# Altium schematic sheet display.SchDoc
size A4; SheetNumber: 5; SheetTotal: 7
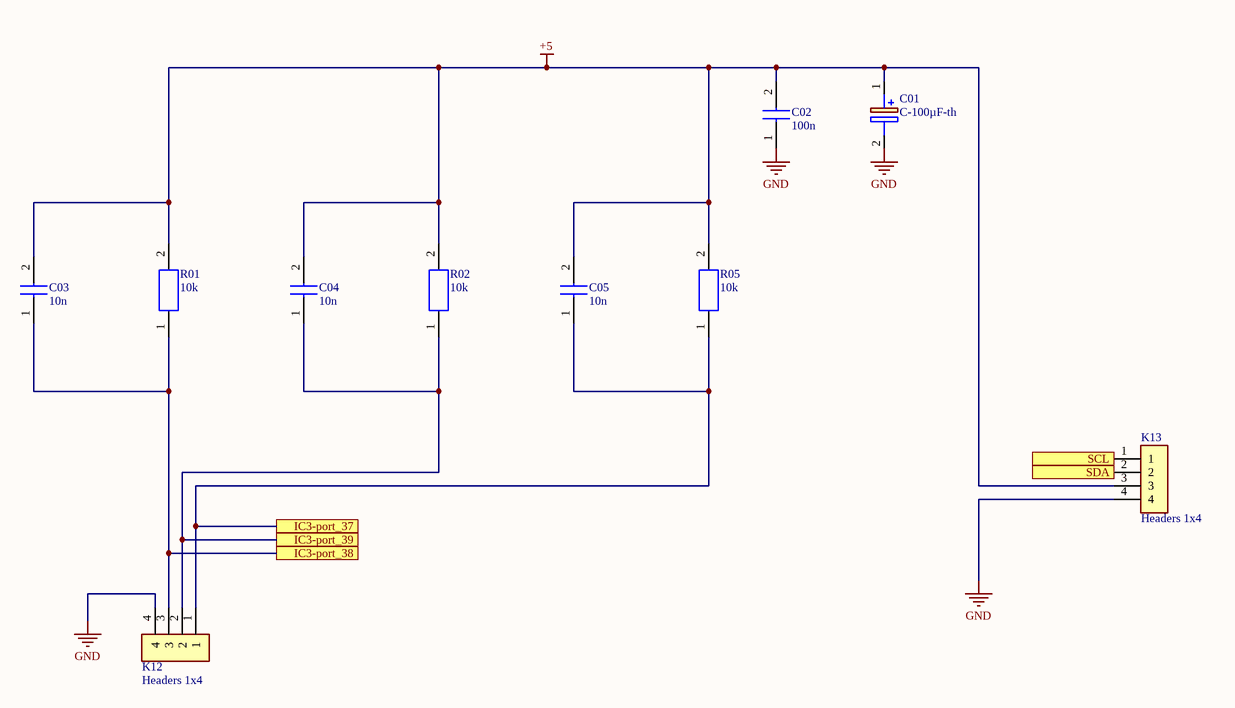
[diagram p0: display.SchDoc]

## Parts
C01  C-100µF-th  [C-100µF-th]
C02  100n  [C-0805-smd]
C03  10n  [C-0805-smd]
C04  10n  [C-0805-smd]
C05  10n  [C-0805-smd]
K12  Headers 1x4  [Headers 1x4]
K13  Headers 1x4  [Headers 1x4]
R01  10k  [R-0805]
R02  10k  [R-0805]
R05  10k  [R-0805]

## Ports
IC3-port_37, IC3-port_38, IC3-port_39, SCL, SDA

## Nets
+5: C01.1(+) C02.2 C03.2 C04.2 C05.2 K13.3 R01.2 R02.2 R05.2
GND: C01.2(-) C02.1 K12.4 K13.4
IC3-port_37: C05.1 K12.1 R05.1 ; port IC3-port_37
IC3-port_38: C03.1 K12.3 R01.1 ; port IC3-port_38
IC3-port_39: C04.1 K12.2 R02.1 ; port IC3-port_39
SCL: K13.1 ; port SCL
SDA: K13.2 ; port SDA

## Library data of the parts
C01 = C-100µF-th: Capacitor Polarised; Manufacturer_Name: Kemet; Manufacturer_Part_Number: ESK107M050AG3EA; Height: 12.5mm
C02 C03 C04 C05 = C-0805-smd: Capacitor; Manufacturer_Name: Kemet; Manufacturer_Part_Number: C0805C301G5GACTU; Datasheet Link: https://connect.kemet.com:7667/gateway/IntelliData-ComponentDocumentation/1.0/download/specsheet/C0805C301G5GACTU; Height: 0.88mm
K12 K13 = Headers 1x4: Connector; Manufacturer_Name: TE Connectivity; Manufacturer_Part_Number: 2-826646-0; Datasheet Link: https://componentsearchengine.com/Datasheets/1/2-826646-0.pdf; Height: 8.8mm
R01 R02 R05 = R-0805: Resistor; Manufacturer_Name: Vishay; Manufacturer_Part_Number: TNPU0805500RAZEN00; Height: 0.55mm